# Altium schematic sheet Mode1.SchDoc
size A4
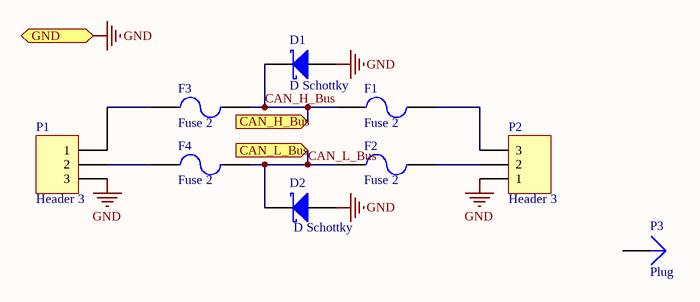
[diagram p0: Mode1.SchDoc]

## Parts
D1  D Schottky  [SMB]
D2  D Schottky  [SMB]
F1  Fuse 2  [12Z-2010]
F2  Fuse 2  [12Z-2010]
F3  Fuse 2  [12Z-2010]
F4  Fuse 2  [12Z-2010]
P1  Header 3  [DZ-3-5.08]
P2  Header 3  [DZ-3-5.08]
P3  Plug  [定位孔 Φ3.2]

## Ports
CAN_H_Bus (in), CAN_L_Bus (in), GND (in)

## Nets
GND: D1.1(A) D2.1(A) P1.3 P2.1 ; port GND
CAN_H_Bus: D1.2(K) F1.1 F3.1 ; port CAN_H_Bus
CAN_L_Bus: D2.2(K) F2.1 F4.1 ; port CAN_L_Bus
NetF1_2: F1.2 P2.3
NetF2_2: F2.2 P2.2
NetF3_2: F3.2 P1.1
NetF4_2: F4.2 P1.2

Not connected (* = marked no-connect by the designer): P3 1

## Library data of the parts
D1 D2 = D Schottky: Schottky Diode; Published: 8-Jun-2000; LatestRevisionDate: 17-Jul-2002; LatestRevisionNote: Re-released for DXP Platform.; PackageReference: SMB; Publisher: Altium Limited; PackageDescription: DO-214-AA/SMB; 2 C-Bend Leads; Body 5.3 x 3.6 mm, inc. leads (LxW); Code_JEDEC: DO-214-AA
F1-F4 = Fuse 2: Fuse; Published: 8-Jun-2000; LatestRevisionDate: 17-Jul-2002; LatestRevisionNote: Re-released for DXP Platform.; PackageReference: PIN-W2/E2.8; Publisher: Altium Limited; PackageDescription: Thru-Hole; 2 Leads
P1 P2 = Header 3: Header, 3-Pin; LatestRevisionDate: 17-Jul-2002; LatestRevisionNote: Re-released for DXP Platform.; Publisher: Altium Limited
P3 = Plug: LatestRevisionDate: 17-Jul-2002; LatestRevisionNote: Re-released for DXP Platform.; Publisher: Altium Limited